# Altium schematic sheet Input.SchDoc
size A4; SheetNumber: 2; SheetTotal: 4
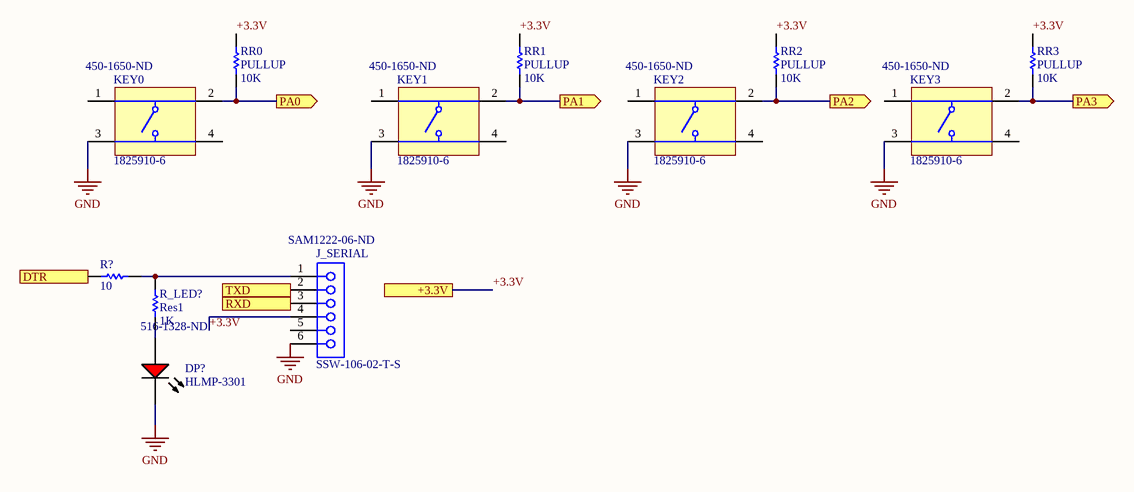
[diagram p0: Input.SchDoc]

## Parts
DP?  HLMP-3301  Supplier Part Number 1: 516-1328-ND  [AVAG-HLMP-3301-2]
J_SERIAL  SSW-106-02-T-S  Supplier Part Number 1: SAM1222-06-ND  [SMTC-SSW-106-02-X-S]
KEY0  1825910-6  Supplier Part Number 1: 450-1650-ND  [TECO-1825910-6_V]
KEY1  1825910-6  Supplier Part Number 1: 450-1650-ND  [TECO-1825910-6_V]
KEY2  1825910-6  Supplier Part Number 1: 450-1650-ND  [TECO-1825910-6_V]
KEY3  1825910-6  Supplier Part Number 1: 450-1650-ND  [TECO-1825910-6_V]
R?  10  [AXIAL-0.1-RES]
R_LED?  Res1  value 1K  [AXIAL-0.1-RES]
RR0  PULLUP  value 10K  [AXIAL-0.1-RES]
RR1  PULLUP  value 10K  [AXIAL-0.1-RES]
RR2  PULLUP  value 10K  [AXIAL-0.1-RES]
RR3  PULLUP  value 10K  [AXIAL-0.1-RES]

## Ports
+3.3V, DTR (out), PA0 (out), PA1 (out), PA2 (out), PA3 (out), RXD (in), TXD (out)

## Nets
GND: DP?.1(K) J_SERIAL.6 KEY0.3 KEY1.3 KEY2.3 KEY3.3
+3.3V: J_SERIAL.4 RR0.2 RR1.2 RR2.2 RR3.2 ; port +3.3V
DTR: R?.1 ; port DTR
PA0: KEY0.2 RR0.1 ; port PA0
PA1: KEY1.2 RR1.1 ; port PA1
PA2: KEY2.2 RR2.1 ; port PA2
PA3: KEY3.2 RR3.1 ; port PA3
RXD: J_SERIAL.3 ; port RXD
TXD: J_SERIAL.2 ; port TXD
NetDP?_2: DP?.2(A) R_LED?.1
NetJ_SERIAL_1: J_SERIAL.1 R?.2 R_LED?.2

Not connected (* = marked no-connect by the designer): J_SERIAL 5; KEY0 1 4; KEY1 1 4; KEY2 1 4; KEY3 1 4

## Library data of the parts
DP? = CMP-2000-06411-1: T-1 3/4 (5 mm) Diffused LED Lamp, 1.9 V, -40 to 100 degC, 2-Pin THD, RoHS, Bulk; Manufacturer: Avago; Forward Current: 25mA; Forward Voltage: 2.4V; Peak Wavelength: 635nm; Shape Type: Circular; High Brightness: No; Main Category: StandardLED; Test Current (It): 10mA; Dominant Wave Length: 626nm; Number of  Elements: 1; Reverse Voltage: 5V; Chip Material: GaP; Product Height (mm): 9.19mm; Lens Type: ColoredDiffused; Viewing Angle: 60deg; Emitting Color: Red; Luminous Intensity: 5.4mcd; Power Dissipation: 85W; DELETED: Compliant; Product Depth (mm): 6.1mm; Description: Single Color LED, High Efficiency Red, Tinted Diffused, T-1 3/4, 5mm; Shape: Round; Lens Style: Diffused,Tinted; Forward Current-Max: 30mA; Forward Voltage-Max: 3V; Luminous Intensity-Nom: 7mcd; Optoelectronic Device Type: SINGLE COLOR LED; T-code: T-1 3/4; Overall Height: 8.81mm; Package Description: 2-Pin Through Hole LED, Dia 5.85 mm; Mounting Technology: ThroughHole; Manufacturer URL: http://www.avagotech.com/; Package Type: T-13/4; Operating Temp Range: -40Cto100C; Datasheet URL: http://www.avagotech.com/docs/AV02-1558EN; Mounting: ThroughHole; Lens Dimensions: 5.08x5.08x8.3mm; Package Reference: HLMP-3301; Datasheet Version: 03/2015; Pin Count: 2; Packaging: TapeandReel; Type: Uni-Color; Operating Temperature Classification: Industrial; Lum Intensity: 5.4mcd; Rad Hardened: No; Product Length (mm): 6.1mm; Supplier 1: Digikey; Manufacturer Part Number: HLMP-3301; RoHS: Yes; Category: LEDs; Stock 1: 58393; Pricing 1: 1=0.46, 10=0.283, 100=0.1626, 1000=0.12726, 2000=0.11666, 6000=0.10605, 10000=0.09898, 26000=0.09545 (USD); Mount: Radial; Number of Pins: 2; Color: Red; Color@wavelength: Red; Terminal Finish: Tin; Min Operating Temperature: -55°C; Max Operating Temperature: 100°C; Number of Functions: 1; JESD-609 Code: e3; Size: 5mm; Terminal Pitch: 2.54mm; Reach SVHC Compliant: Yes; RoHS Compliant: Yes; ComponentLink1URL: https://datasheet.ciiva.com:443/pdfs/VipMasterIC/IC/AVGO/AVGOS05640/AVGOS05640-1.pdf?src-supplier=IHS+Markit; ComponentLink1Description: https://datasheet.ciiva.com:443/pdfs/VipMasterIC/IC/AVGO/AVGOS05640/AVGOS05640-1.pdf?src-supplier=IHS+Markit; ComponentLink2URL: https://datasheet.ciiva.com/14183/hlmp3x01-3507-eng-datasheet-14183876.pdf?src-supplier=Distrelec; ComponentLink2Description: https://datasheet.ciiva.com/14183/hlmp3x01-3507-eng-datasheet-14183876.pdf?src-supplier=Distrelec; ComponentLink3URL: https://datasheet.ciiva.com/1244/22186-1244722.pdf?src-supplier=Element14; ComponentLink3Description: https://datasheet.ciiva.com/1244/22186-1244722.pdf?src-supplier=Element14; ComponentLink4URL: https://datasheet.ciiva.com/11773/0900766b80026843-11773762.pdf?src-supplier=Rs; ComponentLink4Description: https://datasheet.ciiva.com/11773/0900766b80026843-11773762.pdf?src-supplier=Rs; ComponentLink5URL: https://datasheet.ciiva.com/15117/getdatasheetpartid-142345-15117743.pdf?src-supplier=Verical; ComponentLink5Description: https://datasheet.ciiva.com/15117/getdatasheetpartid-142345-15117743.pdf?src-supplier=Verical; ComponentLink6URL: https://datasheet.ciiva.com/29334/180620-da-01-en-led-5mm-hlmp-3301-rot-29334892.pdf?src-supplier=Conrad; ComponentLink6Description: https://datasheet.ciiva.com/29334/180620-da-01-en-led-5mm-hlmp-3301-rot-29334892.pdf?src-supplier=Conrad; ComponentLink7URL: https://datasheet.ciiva.com/14603/70157735-14603818.pdf?src-supplier=Allied+Electronics; ComponentLink7Description: https://datasheet.ciiva.com/14603/70157735-14603818.pdf?src-supplier=Allied+Electronics
J_SERIAL = CMP-1023-00360-1: SQ Post Socket, Through-hole, Vertical, -55 to 105 degC, 2.54mm Pitch, 6-Pin, Female, RoHS; Manufacturer: Samtec; Manufacturer Series: SSW-1; Description: Board Connector, 6 Contact(s), 1 Row(s), Female, Straight, 0.1 inch Pitch, Solder Terminal, Locking, Socket; Connector Type: BOARD CONNECTOR; Number of Rows Loaded: 1; Number of Contacts: 6; Contact Pattern: RECTANGULAR; Contact Style: SQ PIN-SKT; Option: General Purpose; Filter Feature: No; Additional Feature: TIGER BUY CONTACT; Mating Information: MULTIPLE MATING PARTS AVAILABLE; Mating Contact Pitch: 0.1inch; Body Breadth: 0.095inch; Body Length: 0.62inch; Mounting Option 1: LOCKING; Reference Standard: UL; Reliability: COMMERCIAL; ComponentLink1URL: http://www.samtec.com; Temperature Range: -55 to 105 degC; Pitch: 2.54 mm; Mounting Technology: Through-hole; DatasheetVersion: F-214; ComponentLink1Description: Manufacturer URL; PackageVersion: CA, 6/1987; ComponentLink3Description: Package Specification; PackageDescription: Assembly, Socket Strip .016 X .031 Tail; ComponentLink2Description: Datasheet; ComponentLink2URL: http://www.samtec.com/documents/webfiles/pdf/SSW_TH.PDF; PackageReference: SSW-106-02-X-S; ComponentLink3URL: http://www.samtec.com/documents/webfiles/cpdf/SSW-1XX-XX-XXX-X-XX-XXX-XX-MKT.pdf; RoHS: True; PartNumber: SSW-106-02-T-S; Orientation: Vertical; Supplier 1: Digikey; Manufacturer Part Number: SSW-106-02-T-S; Category: Connectors; Stock 1: 518; Pricing 1: 1=0.95, 10=0.8, 100=0.7186, 500=0.58794, 1000=0.52261, 5000=0.45729, 10000=0.43442 (USD); Mount: Board; Contact Finish - Termination: Matte Tin (Sn) - with Nickel (Ni) barrier; Contact Finish - Mating: MATTE TIN OVER NICKEL (50); Insulation Material: Polymer; Contact Material: Bronze; JESD-609 Code: e3; Contact Gender: Female; Mounting Style: STRAIGHT; Termination: Solder; Number Of Connectors: 1; Mixed Contacts: No; Number Of PCB Rows: 1; PCB Contact Pattern: RECTANGULAR; Body/Shell Style: SOCKET; Terminal Pitch: 2.54mm; Flammability Rating: UL94 V-0; Reach SVHC Compliant: Yes; RoHS Compliant: Yes; DIN Conformance: No; IEC Conformance: No; MIL Conformance: No; ComponentLink4URL: https://datasheet.ciiva.com:443/pdfs/VipMasterIC/IC/SAMI/SAMI-S-A0000099790/SAMI-S-A0001471334-1.pdf?src-supplier=IHS+Markit; ComponentLink4Description: https://datasheet.ciiva.com:443/pdfs/VipMasterIC/IC/SAMI/SAMI-S-A0000099790/SAMI-S-A0001471334-1.pdf?src-supplier=IHS+Markit; ComponentLink5URL: https://datasheet.ciiva.com/750/ssw-1xx-xx-xxx-x-xx-xxx-xx-mkt-750567.pdf?src-supplier=Digikey; ComponentLink5Description: https://datasheet.ciiva.com/750/ssw-1xx-xx-xxx-x-xx-xxx-xx-mkt-750567.pdf?src-supplier=Digikey
KEY0-KEY3 = CMP-1684-00021-1: Tact Switch, SPST-NO, 0.05 A, -35 to 85 degC, 4-Pin THD, RoHS, Bulk; Manufacturer: TE Connectivity; Maximum Contact Resistance: 100mOhm; Mechanical Life: 100000Cycles; Bushing Type: Unthreaded; Switch Configuration: OFF(ON); Maximum DC Voltage Rating: 24V; Contact Rating @ Voltage: 0.05A@24VDC; Actuator Color: Black; Body Orientation: Straight; Function: MomentaryContact; Illumination: N/R; Actuator Style: RoundButton; Actuator Material: PolybutyleneTerephthalate; Dielectric Strength: 500VAC; Pole Throw Configuration: SPST; Actuator Length: 1.4mm; Description: Keypad Switch, 1 Switches, SPST, Momentary-tactile, 0.05A, 24VDC, 2.06N, 4 PCB Hole Cnt, Solder Terminal, Through Hole-straight; Circuit Configuration: 1X1; Contact Current(DC)-Max: 50mA; Number of Switches: 1; Operating Force-Max: 2.06N; Switch Action: MOMENTARY; Switch Type: Keypad; Contact DC Max Rating R Load: .05A@24VDC; Body Breadth: 5.99inch; Body Height: 3.61mm; Body Length or Diameter: 5.99mm; Product Weight: N/A; Contact Material: CopperAlloy; Housing Material: N/A; Terminal Type: PCPins; Minimum Insulation Resistance: 100MOhm; Package Description: 4-Pin Through Hole Device, Body 5.99 x 5.99 mm, Pitch 6.5 mm; Part No: 1825910-6; Package Reference: THD; Base Material: N/A; Manufacturer URL: http://www.te.com; Contact Plating: Silver; RoHS: Yes; Datasheet Version: Rev. C9; Electrical Life: 100000Cycles; Maximum AC Voltage Rating: N/A; Thread Size: N/R; Operating Temperature: -35to85C; Mounting: ThroughHole; Dimension: 5.99x5mm; Datasheet URL: http://www.te.com/commerce/DocumentDelivery/DDEController?Action=showdoc&DocId=Customer+Drawing%7F1825910%7FC9%7Fpdf%7FEnglish%7FENG_CD_1825910_C9.pdf%7F1825910-6; Family: 1825910; Seal Location: N/A; Seal Description: N/A; Packaging: N/A; Supplier 1: Digikey; Manufacturer Part Number: 1825910-6; Category: Pushbutton Switches; Stock 1: 59562; Pricing 1: 1=0.13, 10=0.125, 25=0.1184, 100=0.1078, 250=0.10132, 500=0.09268, 1000=0.07759, 2500=0.07544, 5000=0.07113 (USD); Mount: Through Hole; Min Operating Temperature: -35°C; Max Operating Temperature: 85°C; Termination: Solder; Contact Voltage(DC)-Max: 24V; Switch Function: SPST; Reach SVHC Compliant: Yes; RoHS Compliant: Yes; ComponentLink1URL: https://datasheet.ciiva.com:443/pdfs/VipMasterIC/IC/TYEL/TYEL-S-A0008869674/TYEL-S-A0008850909-1.pdf?src-supplier=IHS+Markit; ComponentLink1Description: https://datasheet.ciiva.com:443/pdfs/VipMasterIC/IC/TYEL/TYEL-S-A0008869674/TYEL-S-A0008850909-1.pdf?src-supplier=IHS+Markit
R? = RES 10 OHM 5% 1/4W AXIAL: Resistor; Manufacturer Part Number: CFR-25JB-52-10R; Designator: R?; Power Rating: 1/4W; Tolerance: 0.05; Published: 8-Jun-2000; LatestRevisionDate: 17-Jul-2002; LatestRevisionNote: Re-released for DXP Platform.; Publisher: Altium Limited
R_LED? = RES 1K OHM 5% 1/4W AXIAL: Resistor; Manufacturer Part Number: CFR-25JB-52-1K; Designator: R?; Power Rating: 1/4W; Tolerance: 0.05; Published: 8-Jun-2000; LatestRevisionDate: 17-Jul-2002; LatestRevisionNote: Re-released for DXP Platform.; Publisher: Altium Limited
RR0-RR3 = RES 10K OHM 5% 1/4W AXIAL: Resistor; Manufacturer Part Number: CFR-25JB-52-10K; Designator: R?; Power Rating: 1/4W; Tolerance: 0.05; Published: 8-Jun-2000; LatestRevisionDate: 17-Jul-2002; LatestRevisionNote: Re-released for DXP Platform.; Publisher: Altium Limited